# EAGLE board RoboDiscovery-F4_V1.0 (EAGLE 6.5.0), part 1 of 2
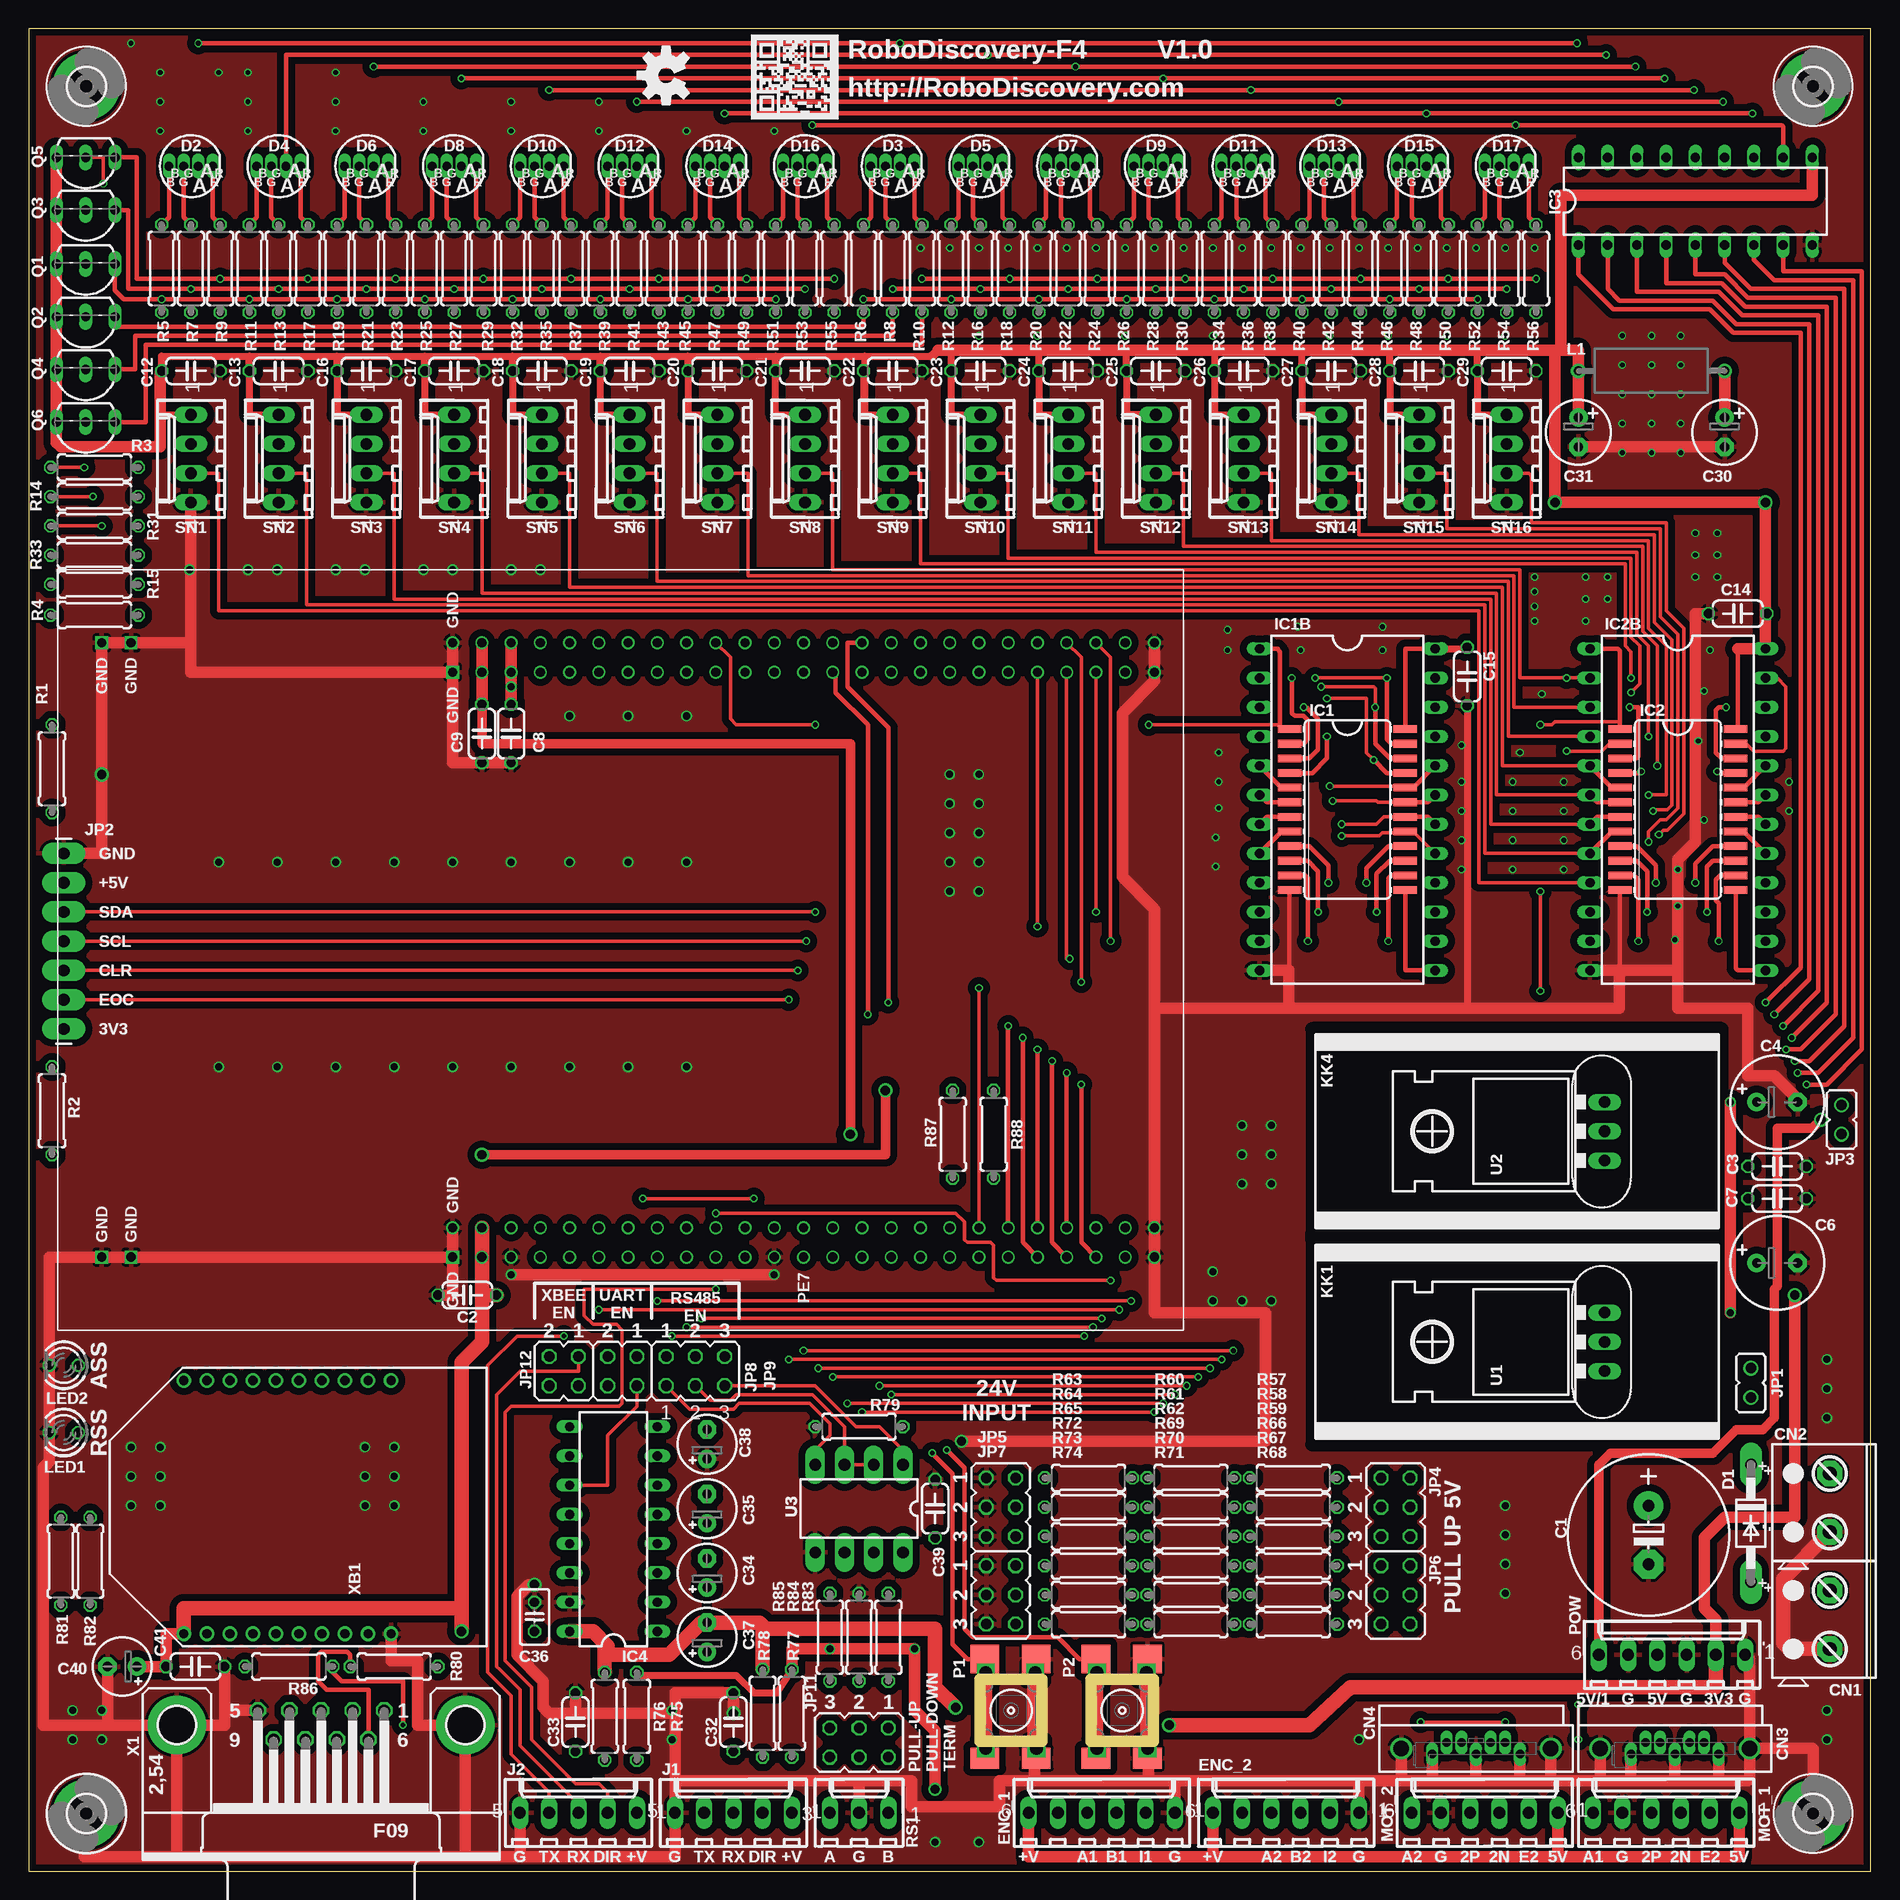
[diagram p6: board, top side]
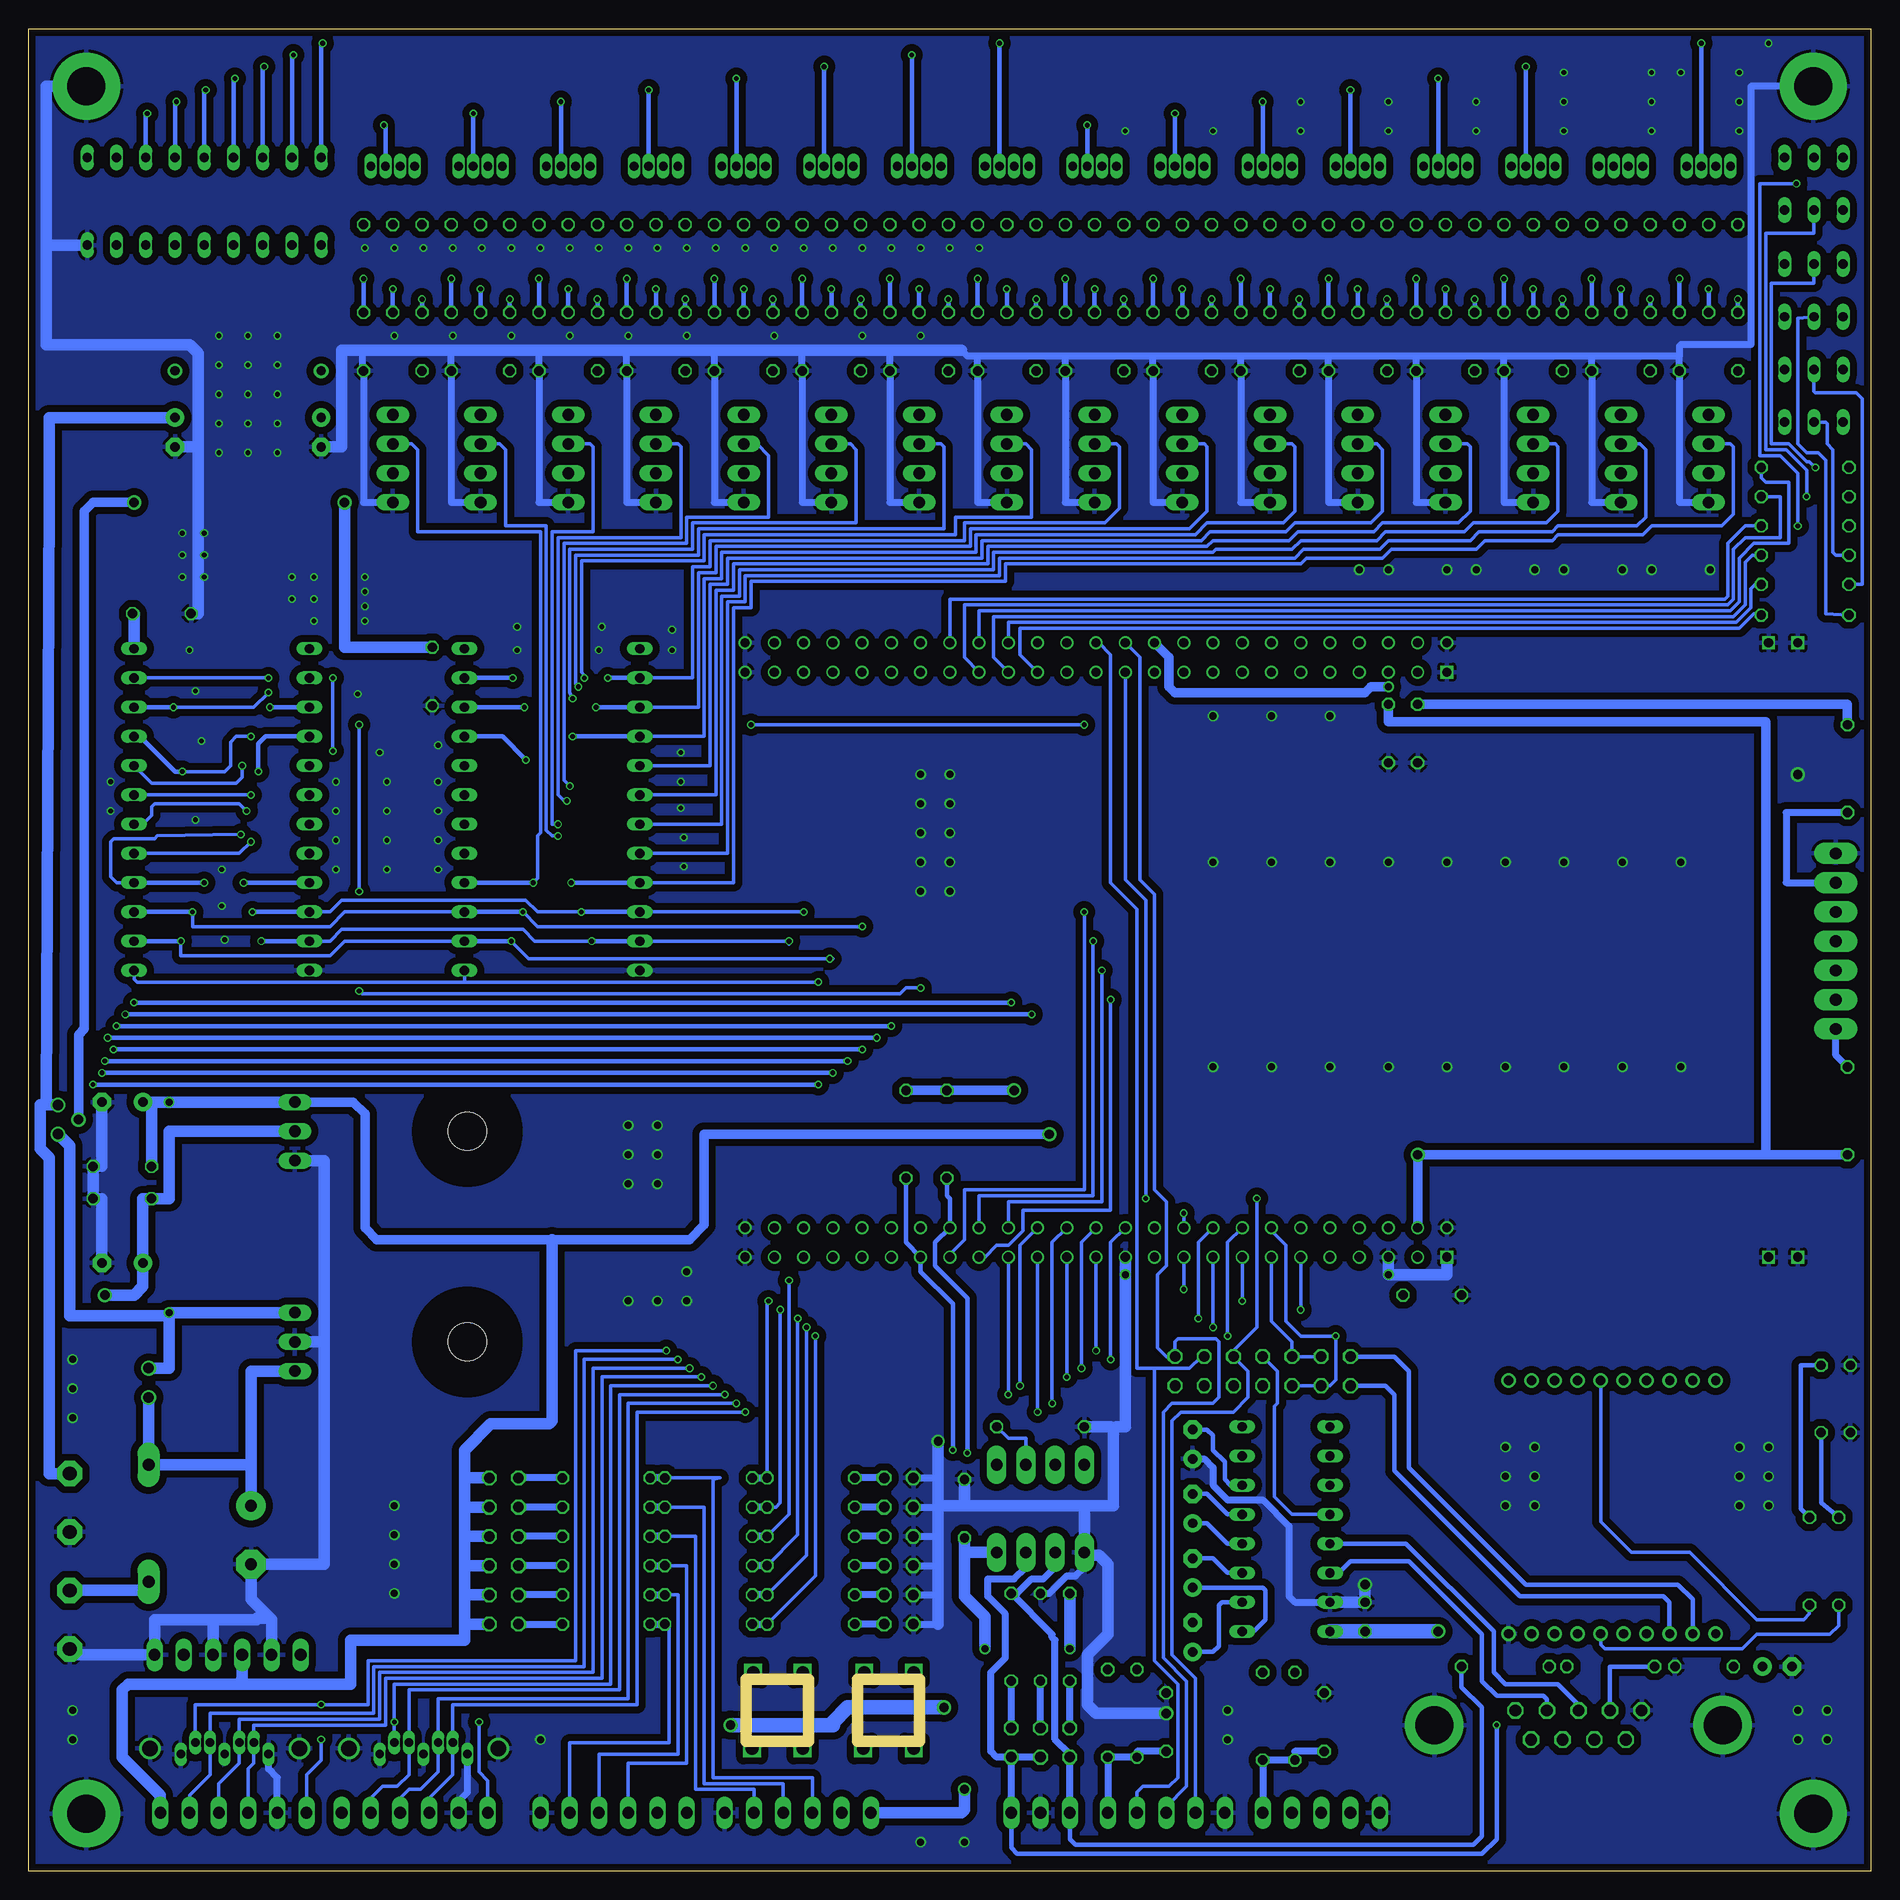
[diagram p7: board, bottom side, seen from below]

Size 160 x 160 mm. Coordinates in mm from the lower left corner, seen from the top.
Outline: 0,0 160,0 160,160 0,160 0,0
Copper layers (1*16): Top 0.035mm / dielectric 1.5mm / Bottom 0.035mm
Design rules "SonarF4_V1.2": minimum track width 10mil, minimum drill 0.3mm, track to track 8mil, track to pad 8mil, pad to pad 8mil, via to via 8mil, smd to smd 8mil, copper to edge 20mil, drill to drill 8mil, minimum pad ring 5mil, minimum via ring 5mil, stop-mask expansion 4mil, vias tented up to drill 17mil, thermal gap 10mil
Net classes: 0 default: width 0.254 mm, drill 0.508 mm

## Footprints (pad centres in the part's own frame; a part is rotated, then mirrored left to right if it is on the bottom)
E5-13 = drill 1.016 pad 2.54: + -2.54,0 | drill 1.016 pad 2.54 octagon: - 2.54,0
C050-024X044 = drill 0.813 octagon: 1 -2.54,0; 2 2.54,0
E3,5-8 = drill 0.813 pad 1.6: + -1.778,0 | drill 0.813 pad 1.6 octagon: - 1.778,0
E2,5-6 = drill 0.813 pad 1.6: + -1.27,0 | drill 0.813 pad 1.6 octagon: - 1.27,0
E2,5-5 = drill 0.813 pad 1.6: + -1.27,0 | drill 0.813 pad 1.6 octagon: - 1.27,0
C025-025X050 = drill 0.813 octagon: 1 -1.27,0; 2 1.27,0
300-021-13_2P/5VE = drill 1.2 pad 2.184 octagon: 1 0,0; 2 5.08,0
SATA-5607-5102-SH = drill 0.737 pad 1.016 long: 1 3.81,-0.5; 2 2.54,0.5; 3 1.27,0.5; 4 0,-0.5; 5 -1.27,0.5; 6 -2.54,0.5; 7 -3.81,-0.5 | drill 1.346: H1 6.49,0; H2 -6.49,0
D041-10 = drill 1.016 pad 1.93 long: A 5.08,0; C -5.08,0
LED-RGB-THRU = drill 0.762 pad 0.889 long: 1 1.905,0; 2 0.635,0; 3 -0.635,0; 4 -1.905,0
STM32F4-DISCOVERY = drill 0.8 square: 1 0,0; 51 50.8,0; G1 0,30.48; G2 0,27.94; G3 53.34,30.48; G4 53.34,27.94 | drill 0.8: 2 2.54,0; 3 0,-2.54; 4 2.54,-2.54; 5 0,-5.08; 6 2.54,-5.08; 7 0,-7.62; 8 2.54,-7.62; 9 0,-10.16; 10 2.54,-10.16; 11 0,-12.7; 12 2.54,-12.7; 13 0,-15.24; 14 2.54,-15.24; 15 0,-17.78; 16 2.54,-17.78; 17 0,-20.32; 18 2.54,-20.32; 19 0,-22.86; 20 2.54,-22.86; 21 0,-25.4; 22 2.54,-25.4; 23 0,-27.94; 24 2.54,-27.94; 25 0,-30.48; 26 2.54,-30.48; 27 0,-33.02; 28 2.54,-33.02; 29 0,-35.56; 30 2.54,-35.56; 31 0,-38.1; 32 2.54,-38.1; 33 0,-40.64; 34 2.54,-40.64; 35 0,-43.18; 36 2.54,-43.18; 37 0,-45.72; 38 2.54,-45.72; 39 0,-48.26; 40 2.54,-48.26; 41 0,-50.8; 42 2.54,-50.8; 43 0,-53.34; 44 2.54,-53.34; 45 0,-55.88; 46 2.54,-55.88; 47 0,-58.42; 48 2.54,-58.42; 49 0,-60.96; 50 2.54,-60.96; 52 53.34,0; 53 50.8,-2.54; 54 53.34,-2.54; 55 50.8,-5.08; 56 53.34,-5.08; 57 50.8,-7.62; 58 53.34,-7.62; 59 50.8,-10.16; 60 53.34,-10.16; 61 50.8,-12.7; 62 53.34,-12.7; 63 50.8,-15.24; 64 53.34,-15.24; 65 50.8,-17.78; 66 53.34,-17.78; 67 50.8,-20.32; 68 53.34,-20.32; 69 50.8,-22.86; 70 53.34,-22.86; 71 50.8,-25.4; 72 53.34,-25.4; 73 50.8,-27.94; 74 53.34,-27.94; 75 50.8,-30.48; 76 53.34,-30.48; 77 50.8,-33.02; 78 53.34,-33.02; 79 50.8,-35.56; 80 53.34,-35.56; 81 50.8,-38.1; 82 53.34,-38.1; 83 50.8,-40.64; 84 53.34,-40.64; 85 50.8,-43.18; 86 53.34,-43.18; 87 50.8,-45.72; 88 53.34,-45.72; 89 50.8,-48.26; 90 53.34,-48.26; 91 50.8,-50.8; 92 53.34,-50.8; 93 50.8,-53.34; 94 53.34,-53.34; 95 50.8,-55.88; 96 53.34,-55.88; 97 50.8,-58.42; 98 53.34,-58.42; 99 50.8,-60.96; 100 53.34,-60.96
6410-06 = drill 1.016 long: 1 6.35,0; 2 3.81,0; 3 1.27,0; 4 -1.27,0; 5 -3.81,0; 6 -6.35,0
3,3-PAD = drill 3.3 pad 5.842: B3,3 0,0
SO24W = smd 0.66 x 2.032: 1 -6.985,-5.029; 2 -5.715,-5.029; 3 -4.445,-5.029; 4 -3.175,-5.029; 5 -1.905,-5.029; 6 -0.635,-5.029; 7 0.635,-5.029; 8 1.905,-5.029; 9 3.175,-5.029; 10 4.445,-5.029; 11 5.715,-5.029; 12 6.985,-5.029; 13 6.985,5.029; 14 5.715,5.029; 15 4.445,5.029; 16 3.175,5.029; 17 1.905,5.029; 18 0.635,5.029; 19 -0.635,5.029; 20 -1.905,5.029; 21 -3.175,5.029; 22 -4.445,5.029; 23 -5.715,5.029; 24 -6.985,5.029
DIL24-6 = drill 0.813 long: 1 -13.97,-7.62; 2 -11.43,-7.62; 3 -8.89,-7.62; 4 -6.35,-7.62; 5 -3.81,-7.62; 6 -1.27,-7.62; 7 1.27,-7.62; 8 3.81,-7.62; 9 6.35,-7.62; 10 8.89,-7.62; 11 11.43,-7.62; 12 13.97,-7.62; 13 13.97,7.62; 14 11.43,7.62; 15 8.89,7.62; 16 6.35,7.62; 17 3.81,7.62; 18 1.27,7.62; 19 -1.27,7.62; 20 -3.81,7.62; 21 -6.35,7.62; 22 -8.89,7.62; 23 -11.43,7.62; 24 -13.97,7.62
DIL18 = drill 0.813 long: 1 -10.16,-3.81; 2 -7.62,-3.81; 3 -5.08,-3.81; 4 -2.54,-3.81; 5 0,-3.81; 6 2.54,-3.81; 7 5.08,-3.81; 8 7.62,-3.81; 9 10.16,-3.81; 10 10.16,3.81; 11 7.62,3.81; 12 5.08,3.81; 13 2.54,3.81; 14 0,3.81; 15 -2.54,3.81; 16 -5.08,3.81; 17 -7.62,3.81; 18 -10.16,3.81
DIL16 = drill 0.813 long: 1 -8.89,-3.81; 2 -6.35,-3.81; 3 -3.81,-3.81; 4 -1.27,-3.81; 5 1.27,-3.81; 6 3.81,-3.81; 7 6.35,-3.81; 8 8.89,-3.81; 9 8.89,3.81; 10 6.35,3.81; 11 3.81,3.81; 12 1.27,3.81; 13 -1.27,3.81; 14 -3.81,3.81; 15 -6.35,3.81; 16 -8.89,3.81
6410-05 = drill 1.016 long: 1 5.08,0; 2 2.54,0; 3 0,0; 4 -2.54,0; 5 -5.08,0
JP1 = drill 0.914: 1 0,-1.27; 2 0,1.27
1X07_LONGPADS = drill 1.016 pad 1.88 long: 1 0,0; 2 2.54,0; 3 5.08,0; 4 7.62,0; 5 10.16,0; 6 12.7,0; 7 15.24,0
JP3Q = drill 0.914 octagon: 1 -2.54,-1.27; 2 -2.54,1.27; 3 0,-1.27; 4 0,1.27; 5 2.54,-1.27; 6 2.54,1.27
JP2Q = drill 0.914 octagon: 1 -1.27,-1.27; 2 1.27,-1.27; 3 -1.27,1.27; 4 1.27,1.27
2200-12.7 = drill 0.8 pad 1.27: 1 -6.35,0; 2 6.35,0
LED3MM = drill 0.813 octagon: A -1.27,0; K 1.27,0
PULS6X6SMD = smd 1.8 x 2.5: 1 -4.156,2.286; 3 -4.156,-2.186 | smd 2.5 x 2.5: 2 4.456,2.286; 4 4.456,-2.186 | drill 1.1 square: P$1 -3.3,2.2; P$2 3.3,2.2; P$3 -3.3,-2.2; P$4 3.3,-2.1
TO92-EBC = drill 0.813 long: B 0,-1.27; C -2.54,-1.27; E 2.54,-1.27
0207/7 = drill 0.813 octagon: 1 -3.81,0; 2 3.81,0
6410-03 = drill 1.016 long: 1 2.54,0; 2 0,0; 3 -2.54,0
6410-04 = drill 1.016 long: 1 3.81,0; 2 1.27,0; 3 -1.27,0; 4 -3.81,0
78XXL = drill 1.016 long: GND 0,-3.81; IN -2.54,-3.81; OUT 2.54,-3.81 | hole 3.302: 0,11.176
317TL = drill 1.016 long: 1 -2.54,-3.81; 2 0,-3.81; 3 2.54,-3.81 | hole 3.302: 0,11.176
DIL8 = drill 1.016 pad 1.676 long: 1 -3.81,-3.81; 2 -1.27,-3.81; 3 1.27,-3.81; 4 3.81,-3.81; 5 3.81,3.81; 6 1.27,3.81; 7 -1.27,3.81; 8 -3.81,3.81
F09HP = drill 1.016 octagon: 1 -5.486,-1.27; 2 -2.743,-1.27; 3 0,-1.27; 4 2.743,-1.27; 5 5.486,-1.27; 6 -4.115,1.27; 7 -1.372,1.27; 8 1.372,1.27; 9 4.115,1.27 | drill 3.302 pad 5.08: G1 -12.522,0; G2 12.522,0
MAXSTREAM_XBEE-PRO = drill 0.8 pad 1.27: 1 -11,9; 2 -11,7; 3 -11,5; 4 -11,3; 5 -11,1; 6 -11,-1; 7 -11,-3; 8 -11,-5; 9 -11,-7; 10 -11,-9; 11 11,-9; 12 11,-7; 13 11,-5; 14 11,-3; 15 11,-1; 16 11,1; 17 11,3; 18 11,5; 19 11,7; 20 11,9

## Placement (x,y rotation side)
C1  [E5-13]  140.71,29.2 270 top
C2  100nF p5.08  [C050-024X044]  38.09,50.03 180 top
C3  100nF p5.08  [C050-024X044]  151.88,61.2 0 top
C4  470uF 16V P3,5 D8  [E3,5-8]  151.88,66.79 0 top
C6  470uF 16V P3,5 D8  [E3,5-8]  151.88,52.82 0 top
C7  100nF p5.08  [C050-024X044]  151.88,58.41 0 top
C8  100nF p5.08  [C050-024X044]  41.9,98.8 270 top
C9  100nF p5.08  [C050-024X044]  39.36,98.8 270 top
C12  100nF p5.08  [C050-024X044]  14.09,130.29 0 top
C13  100nF p5.08  [C050-024X044]  21.71,130.29 0 top
C14  100nF p5.08  [C050-024X044]  148.45,109.21 180 top
C15  100nF p5.08  [C050-024X044]  124.96,103.75 270 top
C16  100nF p5.08  [C050-024X044]  29.33,130.29 0 top
C17  100nF p5.08  [C050-024X044]  36.95,130.29 0 top
C18  100nF p5.08  [C050-024X044]  44.57,130.29 0 top
C19  100nF p5.08  [C050-024X044]  52.19,130.29 0 top
C20  100nF p5.08  [C050-024X044]  59.81,130.29 0 top
C21  100nF p5.08  [C050-024X044]  67.43,130.29 0 top
C22  100nF p5.08  [C050-024X044]  75.05,130.29 0 top
C23  100nF p5.08  [C050-024X044]  82.67,130.29 0 top
C24  100nF p5.08  [C050-024X044]  90.29,130.29 0 top
C25  100nF p5.08  [C050-024X044]  97.91,130.29 0 top
C26  100nF p5.08  [C050-024X044]  105.53,130.29 0 top
C27  100nF p5.08  [C050-024X044]  113.15,130.29 0 top
C28  100nF p5.08  [C050-024X044]  120.77,130.29 0 top
C29  100nF p5.08  [C050-024X044]  128.39,130.29 0 top
C30  100uF 25V p2.54  [E2,5-6]  147.31,124.96 270 top
C31  100uF 25V p2.54  [E2,5-6]  134.61,124.96 270 top
C32  100nF p5.08  [C050-024X044]  61.2,12.94 90 top
C33  100nF p5.08  [C050-024X044]  47.49,12.94 90 top
C34  1uF 16V  [E2,5-5]  58.92,25.9 90 top
C35  1uF 16V  [E2,5-5]  58.92,31.49 90 top
C36  100nF  [C025-025X050]  43.93,22.09 270 top
C37  1uF 16V  [E2,5-5]  58.92,20.31 90 top
C38  1uF 16V  [E2,5-5]  58.92,37.07 90 top
C39  100nF p5.08  [C050-024X044]  78.73,31.49 90 top
C40  10uF 25V  [E2,5-5]  8.12,17.77 180 top
C41  100nF p5.08  [C050-024X044]  14.47,17.77 0 top
CN1  10.8060.0008  [300-021-13_2P/5VE]  156.45,19.29 90 top
CN2  10.8060.0008  [300-021-13_2P/5VE]  156.45,29.45 90 top
CN3  SATA-7  [SATA-5607-5102-SH]  142.99,10.66 0 top
CN4  SATA-7  [SATA-5607-5102-SH]  125.72,10.66 0 top
D1  1N4007  [D041-10]  149.6,30.22 270 top
D2  LED-RGB-CC-THRUDIFFUSE  [LED-RGB-THRU]  14.09,148.07 0 top
D3  LED-RGB-CC-THRUDIFFUSE  [LED-RGB-THRU]  75.05,148.07 0 top
D4  LED-RGB-CC-THRUDIFFUSE  [LED-RGB-THRU]  21.71,148.07 0 top
D5  LED-RGB-CC-THRUDIFFUSE  [LED-RGB-THRU]  82.67,148.07 0 top
D6  LED-RGB-CC-THRUDIFFUSE  [LED-RGB-THRU]  29.33,148.07 0 top
D7  LED-RGB-CC-THRUDIFFUSE  [LED-RGB-THRU]  90.29,148.07 0 top
D8  LED-RGB-CC-THRUDIFFUSE  [LED-RGB-THRU]  36.95,148.07 0 top
D9  LED-RGB-CC-THRUDIFFUSE  [LED-RGB-THRU]  97.91,148.07 0 top
D10  LED-RGB-CC-THRUDIFFUSE  [LED-RGB-THRU]  44.57,148.07 0 top
D11  LED-RGB-CC-THRUDIFFUSE  [LED-RGB-THRU]  105.53,148.07 0 top
D12  LED-RGB-CC-THRUDIFFUSE  [LED-RGB-THRU]  52.19,148.07 0 top
D13  LED-RGB-CC-THRUDIFFUSE  [LED-RGB-THRU]  113.15,148.07 0 top
D14  LED-RGB-CC-THRUDIFFUSE  [LED-RGB-THRU]  59.81,148.07 0 top
D15  LED-RGB-CC-THRUDIFFUSE  [LED-RGB-THRU]  120.77,148.07 0 top
D16  LED-RGB-CC-THRUDIFFUSE  [LED-RGB-THRU]  67.43,148.07 0 top
D17  LED-RGB-CC-THRUDIFFUSE  [LED-RGB-THRU]  128.39,148.07 0 top
DIS1  STM32F4-DISCOVERY  [STM32F4-DISCOVERY]  36.82,53.33 90 top
ENC_1  J2541406-R  [6410-06]  93.21,5.07 0 top
ENC_2  J2541406-R  [6410-06]  109.21,5.07 0 top
H1  MOUNT-PAD-ROUND3.3  [3,3-PAD]  155,5 0 top
H2  MOUNT-PAD-ROUND3.3  [3,3-PAD]  5,5 0 top
H3  MOUNT-PAD-ROUND3.3  [3,3-PAD]  155,155 0 top
H4  MOUNT-PAD-ROUND3.3  [3,3-PAD]  5,155 0 top
IC1  74HC4067DB  [SO24W]  114.54,92.19 270 top
IC1B  74HC4067DB  [DIL24-6]  114.54,92.19 270 top
IC2  74HC4067DB  [SO24W]  143.25,92.19 270 top
IC2B  74HC4067DB  [DIL24-6]  143.25,92.19 270 top
IC3  ULN2804A  [DIL18]  144.77,145.02 0 top
IC4  ST3232CN  [DIL16]  50.79,29.71 90 top
J1  J2541405-R  [6410-05]  61.2,5.07 0 top
J2  J2541405-R  [6410-05]  47.74,5.07 0 top
JP1  [JP1]  149.6,42.41 0 top
JP2  [1X07_LONGPADS]  3.04,73.14 90 top
JP3  [JP1]  157.47,65.27 0 top
JP4  STREP3x2VERT  [JP3Q]  118.73,31.61 270 top
JP5  STREP3x2VERT  [JP3Q]  84.44,31.61 270 top
JP6  STREP3x2VERT  [JP3Q]  118.73,23.99 270 top
JP7  STREP3x2VERT  [JP3Q]  84.44,23.99 270 top
JP8  [JP2Q]  51.55,43.42 180 top
JP9  STREP3x2VERT  [JP3Q]  57.9,43.42 0 top
JP11  STREP3x2VERT  [JP3Q]  72.13,11.17 180 top
JP12  [JP2Q]  46.47,43.42 180 top
KK1  SK13/35  [SK13/35]  133.09,45.96 0 top
KK4  SK13/35  [SK13/35]  133.09,64.25 0 top
L1  [2200-12.7]  140.96,130.29 180 top
LED1  LEDY3MM  [LED3MM]  3.04,38.09 180 top
LED2  LEDG3MM  [LED3MM]  3.04,43.93 180 top
LOGO1  OSHW-LOGOM  [OSHW-LOGO-M]  55.36,155.95 90 top
MOT_1  J2541406-R  [6410-06]  142.23,5.07 0 top
MOT_2  J2541406-R  [6410-06]  126.48,5.07 0 top
P1  PULS6X6SMD  [PULS6X6SMD]  85.33,13.96 90 top
P2  PULS6X6SMD  [PULS6X6SMD]  94.99,13.96 90 top
POW  J2541406-R  [6410-06]  142.74,18.79 0 top
Q1  BC327-40  [TO92-EBC]  4.94,138.29 180 top
Q2  BC327-40  [TO92-EBC]  4.94,133.72 180 top
Q3  BC327-40  [TO92-EBC]  4.94,142.99 180 top
Q4  BC327-40  [TO92-EBC]  4.94,129.15 180 top
Q5  BC327-40  [TO92-EBC]  4.94,147.56 180 top
Q6  BC327-40  [TO92-EBC]  4.94,124.58 180 top
R1  0R  [0207/7]  2.02,95.75 270 top
R2  0R  [0207/7]  2.02,66.03 90 top
R3  [0207/7]  5.7,121.91 0 top
R4  [0207/7]  5.7,109.08 0 top
R5  [0207/7]  11.55,139.18 270 top
R6  [0207/7]  72.51,139.18 270 top
R7  [0207/7]  14.09,139.18 270 top
R8  [0207/7]  75.05,139.18 270 top
R9  [0207/7]  16.63,139.18 270 top
R10  [0207/7]  77.59,139.18 270 top
R11  [0207/7]  19.17,139.18 270 top
R12  [0207/7]  80.13,139.18 270 top
R13  [0207/7]  21.71,139.18 270 top
R14  [0207/7]  5.7,119.37 0 top
R15  [0207/7]  5.7,111.75 0 top
R16  [0207/7]  82.67,139.18 270 top
R17  [0207/7]  24.25,139.18 270 top
R18  [0207/7]  85.21,139.18 270 top
R19  [0207/7]  26.79,139.18 270 top
R20  [0207/7]  87.75,139.18 270 top
R21  [0207/7]  29.33,139.18 270 top
R22  [0207/7]  90.29,139.18 270 top
R23  [0207/7]  31.87,139.18 270 top
R24  [0207/7]  92.83,139.18 270 top
R25  [0207/7]  34.41,139.18 270 top
R26  [0207/7]  95.37,139.18 270 top
R27  [0207/7]  36.95,139.18 270 top
R28  [0207/7]  97.91,139.18 270 top
R29  [0207/7]  39.49,139.18 270 top
R30  [0207/7]  100.45,139.18 270 top
R31  [0207/7]  5.7,116.83 0 top
R32  [0207/7]  42.03,139.18 270 top
R33  [0207/7]  5.7,114.29 0 top
R34  [0207/7]  102.99,139.18 270 top
R35  [0207/7]  44.57,139.18 270 top
R36  [0207/7]  105.53,139.18 270 top
R37  [0207/7]  47.11,139.18 270 top
R38  [0207/7]  108.07,139.18 270 top
R39  [0207/7]  49.65,139.18 270 top
R40  [0207/7]  110.61,139.18 270 top
R41  [0207/7]  52.19,139.18 270 top
R42  [0207/7]  113.15,139.18 270 top
R43  [0207/7]  54.73,139.18 270 top
R44  [0207/7]  115.69,139.18 270 top
R45  [0207/7]  57.27,139.18 270 top
R46  [0207/7]  118.23,139.18 270 top
R47  [0207/7]  59.81,139.18 270 top
R48  [0207/7]  120.77,139.18 270 top
R49  [0207/7]  62.35,139.18 270 top
R50  [0207/7]  123.31,139.18 270 top
R51  [0207/7]  64.89,139.18 270 top
R52  [0207/7]  125.85,139.18 270 top
R53  [0207/7]  67.43,139.18 270 top
R54  [0207/7]  128.39,139.18 270 top
R55  [0207/7]  69.97,139.18 270 top
R56  [0207/7]  130.93,139.18 270 top
R57  10K  [0207/7]  109.84,34.15 0 top
R58  10K  [0207/7]  109.84,31.61 0 top
R59  10K  [0207/7]  109.84,29.07 0 top
R60  22K  [0207/7]  100.95,34.15 0 top
R61  22K  [0207/7]  100.95,31.61 0 top
R62  22K  [0207/7]  100.95,29.07 0 top
R63  4K7  [0207/7]  92.06,34.15 0 top
R64  4K7  [0207/7]  92.06,31.61 0 top
R65  4K7  [0207/7]  92.06,29.07 0 top
R66  10K  [0207/7]  109.84,26.53 0 top
R67  10K  [0207/7]  109.84,23.99 0 top
R68  10K  [0207/7]  109.84,21.45 0 top
R69  22K  [0207/7]  100.95,26.53 0 top
R70  22K  [0207/7]  100.95,23.99 0 top
R71  22K  [0207/7]  100.95,21.45 0 top
R72  4K7  [0207/7]  92.06,26.53 0 top
R73  4K7  [0207/7]  92.06,23.99 0 top
R74  4K7  [0207/7]  92.06,21.45 0 top
R75  0R  [0207/7]  52.82,13.45 270 top
R76  0R  [0207/7]  50.03,13.45 270 top
R77  0R  [0207/7]  66.28,13.71 270 top
R78  0R  [0207/7]  63.74,13.71 270 top
R79  100K  [0207/7]  72.13,38.6 0 top
R80  0R  [0207/7]  31.74,17.77 0 top
R81  3K3  [0207/7]  2.78,26.91 90 top
R82  3K3  [0207/7]  5.32,26.91 270 top
R83  120R  [0207/7]  74.67,20.31 270 top
R84  470R  [0207/7]  72.13,20.31 90 top
R85  470R  [0207/7]  69.59,20.31 270 top
R86  0R  [0207/7]  22.6,17.77 180 top
R87  10K  [0207/7]  80.25,64 270 top
R88  10K  [0207/7]  83.81,64 270 top
RS1  J2541403-R  [6410-03]  72.13,5.07 0 top
SN1  [6410-04]  14.09,122.67 90 top
SN2  [6410-04]  21.71,122.67 90 top
SN3  [6410-04]  29.33,122.67 90 top
SN4  [6410-04]  36.95,122.67 90 top
SN5  [6410-04]  44.57,122.67 90 top
SN6  [6410-04]  52.19,122.67 90 top
SN7  [6410-04]  59.81,122.67 90 top
SN8  [6410-04]  67.43,122.67 90 top
SN9  [6410-04]  75.05,122.67 90 top
SN10  [6410-04]  82.67,122.67 90 top
SN11  [6410-04]  90.29,122.67 90 top
SN12  [6410-04]  97.91,122.67 90 top
SN13  [6410-04]  105.53,122.67 90 top
SN14  [6410-04]  113.15,122.67 90 top
SN15  [6410-04]  120.77,122.67 90 top
SN16  [6410-04]  128.39,122.67 90 top
U1  L78XXAB/AC  [78XXL]  133.09,45.96 90 top
U2  LD1117V33  [317TL]  133.09,64.25 90 top
U3  SN65176BD  [DIL8]  72.13,31.49 180 top
X1  DB9 femmina  [F09HP]  25.39,12.69 180 top
XB1  MAXSTREAM_XBEE-PRO  [MAXSTREAM_XBEE-PRO]  22.47,31.61 90 top